# EAGLE design 4CoilController_v2 (EAGLE 9.6.2)
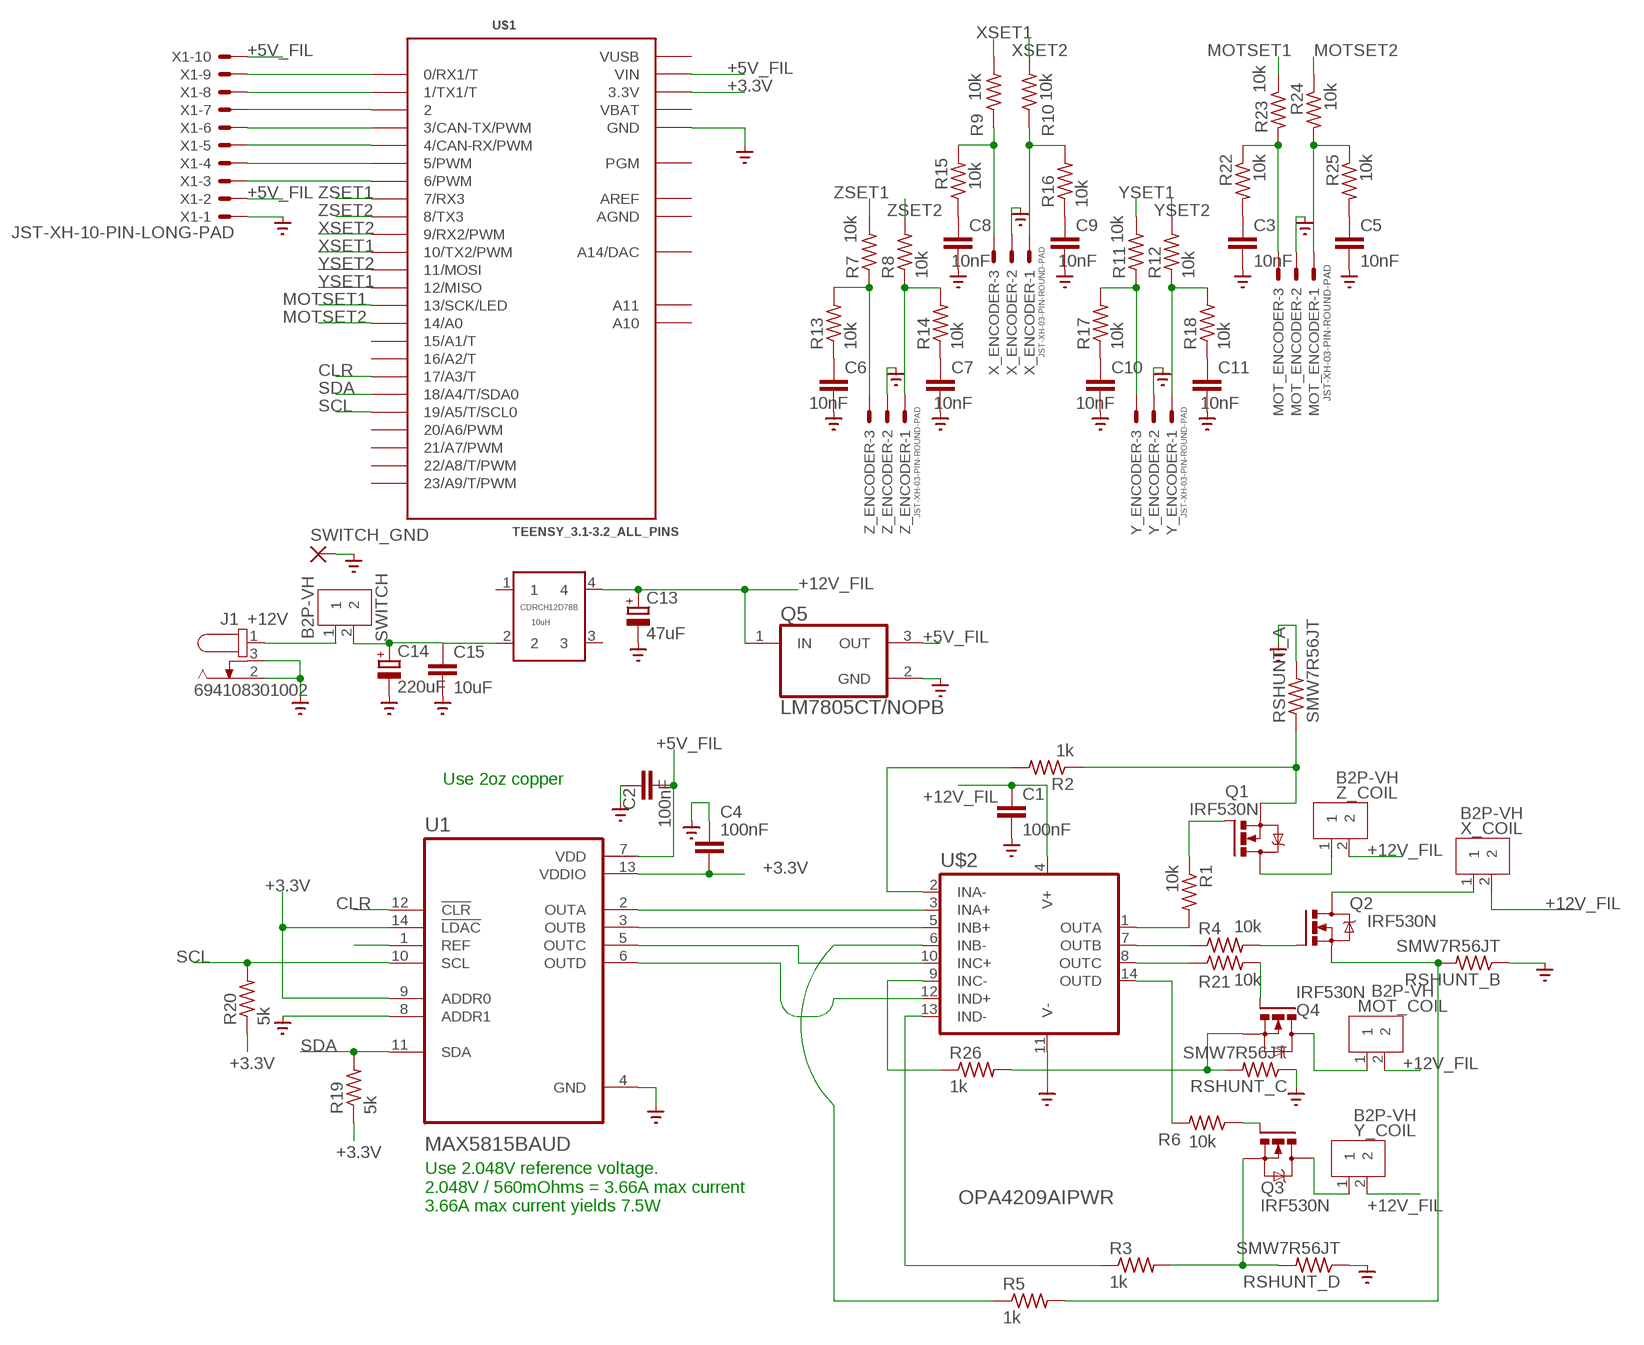
[diagram p0: schematic, sheet 1]

## Parts
C1  100nF  C-EUC0603  [C0603]
C2  100nF  C-EUC0603  [C0603]
C3  10nF  C-EUC0603  [C0603]
C4  100nF  C-EUC0603  [C0603]
C5  10nF  C-EUC0603  [C0603]
C6  10nF  C-EUC0603  [C0603]
C7  10nF  C-EUC0603  [C0603]
C8  10nF  C-EUC0603  [C0603]
C9  10nF  C-EUC0603  [C0603]
C10  10nF  C-EUC0603  [C0603]
C11  10nF  C-EUC0603  [C0603]
C13  47uF  CPOL-EU175TMP-0808  [175TMP-0808]
C14  220uF  CPOL-EUE3.5-8  [E3,5-8]
C15  10uF  C-EUC1206  [C1206]
J1  694108301002  [694108301002]
MOT_COIL  B2P-VH  [B2P-VH_396-2N]
MOT_ENCODER  JST-XH-03-PIN-ROUND-PAD  [JST-XH-03-PACKAGE-ROUND-PAD]
Q1  IRF530N  IRF540  [TO220BV]
Q2  IRF530N  IRF540  [TO220BV]
Q3  IRF530N  IRF540  [TO220BV]
Q4  IRF530N  IRF540  [TO220BV]
Q5  LM7805CT/NOPB  [TO254P1054X470X2600-3]
R1  10k  R-US_R1206  [R1206]
R2  1k  R-US_R1206  [R1206]
R3  1k  R-US_R1206  [R1206]
R4  10k  R-US_R1206  [R1206]
R5  1k  R-US_R1206  [R1206]
R6  10k  R-US_R1206  [R1206]
R7  10k  R-US_R0603  [R0603]
R8  10k  R-US_R0603  [R0603]
R9  10k  R-US_R0603  [R0603]
R10  10k  R-US_R0603  [R0603]
R11  10k  R-US_R0603  [R0603]
R12  10k  R-US_R0603  [R0603]
R13  10k  R-US_R0603  [R0603]
R14  10k  R-US_R0603  [R0603]
R15  10k  R-US_R0603  [R0603]
R16  10k  R-US_R0603  [R0603]
R17  10k  R-US_R0603  [R0603]
R18  10k  R-US_R0603  [R0603]
R19  5k  R-US_R0603  [R0603]
R20  5k  R-US_R0603  [R0603]
R21  10k  R-US_R0603  [R0603]
R22  10k  R-US_R0603  [R0603]
R23  10k  R-US_R0603  [R0603]
R24  10k  R-US_R0603  [R0603]
R25  10k  R-US_R0603  [R0603]
R26  1k  R-US_R0603  [R0603]
RSHUNT_A  SMW7R56JT  [SMW7R56JT]
RSHUNT_B  SMW7R56JT  [SMW7R56JT]
RSHUNT_C  SMW7R56JT  [SMW7R56JT]
RSHUNT_D  SMW7R56JT  [SMW7R56JT]
SWITCH  B2P-VH  [B2P-VH_396-2N]
SWITCH_GND  3,81/1,4  [3,81/1,4]
U1  MAX5815BAUD  [SOP65P640X110-14N]
U$1  TEENSY_3.1-3.2_ALL_PINS  [TEENSY_3.0-3.2&LC_ALL_PINS]
U$2  OPA4209AIPWR  [SOP65P640X120-14N]
U$3  10uH  CDRCH12D78BCDRCH12D78B  [INDDFN1220X1220X800-4N]
X1  JST-XH-10-PIN-LONG-PAD  [JST-XH-10-PACKAGE-LONG-PAD]
X_COIL  B2P-VH  [B2P-VH_396-2N]
X_ENCODER  JST-XH-03-PIN-ROUND-PAD  [JST-XH-03-PACKAGE-ROUND-PAD]
Y_COIL  B2P-VH  [B2P-VH_396-2N]
Y_ENCODER  JST-XH-03-PIN-ROUND-PAD  [JST-XH-03-PACKAGE-ROUND-PAD]
Z_COIL  B2P-VH  [B2P-VH_396-2N]
Z_ENCODER  JST-XH-03-PIN-ROUND-PAD  [JST-XH-03-PACKAGE-ROUND-PAD]

## Nets
+3.3V: C4.2 R19.1 R20.1 U1.9(ADDR0) U1.13(VDDIO) U1.14(!LDAC) U$1.3.3V U$1.3.3V1(3.3V)
+5V_FIL: C2.2 Q5.3(OUT) U1.7(VDD) U$1.VIN X1.2 X1.10
+12V: C14.+ C15.1 SWITCH.2 U$3.2
+12V_FIL: C1.1 C13.+ MOT_COIL.2 Q5.1(IN) U$2.4(V+) U$3.4 X_COIL.2 Y_COIL.2 Z_COIL.2
CLR: U1.12(!CLR) U$1.17/A3(17/A3/T)
GND: C1.2 C2.1 C3.2 C4.1 C5.2 C6.2 C7.2 C8.2 C9.2 C10.2 C11.2 C13.- C14.- C15.2 J1.2 J1.3 MOT_ENCODER.2 Q5.2(GND) RSHUNT_A.P$2 RSHUNT_B.P$1 RSHUNT_C.P$1 RSHUNT_D.P$1 SWITCH_GND.1(P) U1.4(GND) U1.8(ADDR1) U$1.GND U$1.GND1(GND) U$2.11(V-) X1.1 X_ENCODER.2 Y_ENCODER.2 Z_ENCODER.2 ; supply symbol labelled SUPPLY0_GND_
MOTSET1: R23.1 U$1.13(13/SCK/LED)
MOTSET2: R24.1 U$1.14/A0
N$1: U1.6(OUTD) U$2.12(IND+)
N$2: U1.3(OUTB) U$2.5(INB+)
N$3: R5.1 U$2.6(INB-)
N$4: U1.2(OUTA) U$2.3(INA+)
N$5: R1.2 U$2.1(OUTA)
N$6: R2.2 U$2.2(INA-)
N$7: Q1.G R1.1
N$8: Q1.S R2.1 RSHUNT_A.P$1
N$9: R7.1 R13.2 Z_ENCODER.3
N$10: Q1.D Z_COIL.1
N$11: R8.1 R14.2 Z_ENCODER.1
N$12: R4.1 U$2.7(OUTB)
N$13: Q2.G R4.2
N$14: Q2.S R5.2 RSHUNT_B.P$2
N$15: R3.1 U$2.13(IND-)
N$16: R6.2 U$2.14(OUTD)
N$17: Q2.D X_COIL.1
N$18: Q3.G R6.1
N$19: Q3.S R3.2 RSHUNT_D.P$2
N$20: Q3.D Y_COIL.1
N$21: R9.1 R15.2 X_ENCODER.3
N$22: R10.1 R16.2 X_ENCODER.1
N$23: R11.1 R17.2 Y_ENCODER.3
N$24: R12.1 R18.2 Y_ENCODER.1
N$25: C6.1 R13.1
N$26: C7.1 R14.1
N$27: C8.1 R15.1
N$28: C9.1 R16.1
N$29: C10.1 R17.1
N$30: C11.1 R18.1
N$31: J1.1 SWITCH.1
N$32: U$1.0(0/RX1/T) X1.9
N$33: U$1.1(1/TX1/T) X1.8
N$34: U$1.2 X1.7
N$35: U$1.3(3/CAN-TX/PWM) X1.6
N$36: U$1.4(4/CAN-RX/PWM) X1.5
N$37: U$1.5(5/PWM) X1.4
N$38: U$1.6(6/PWM) X1.3
N$39: U1.5(OUTC) U$2.10(INC+)
N$40: R26.1 U$2.9(INC-)
N$41: R21.1 U$2.8(OUTC)
N$42: U1.1(REF)
N$43: Q4.S R26.2 RSHUNT_C.P$2
N$44: Q4.G R21.2
N$45: MOT_COIL.1 Q4.D
N$47: MOT_ENCODER.3 R22.1 R23.2
N$48: MOT_ENCODER.1 R24.2 R25.1
N$50: C3.1 R22.2
N$51: C5.1 R25.2
SCL: R20.2 U1.10(SCL) U$1.19/A5(19/A5/T/SCL0)
SDA: R19.2 U1.11(SDA) U$1.18/A4(18/A4/T/SDA0)
XSET1: R9.2 U$1.10(10/TX2/PWM)
XSET2: R10.2 U$1.9(9/RX2/PWM)
YSET1: R11.2 U$1.12(12/MISO)
YSET2: R12.2 U$1.11(11/MOSI)
ZSET1: R7.2 U$1.7(7/RX3)
ZSET2: R8.2 U$1.8(8/TX3)
Unconnected: U$1.15/A1(15/A1/T) U$1.16/A2(16/A2/T) U$1.20/A6(20/A6/PWM) U$1.21/A7(21/A7/PWM) U$1.22/A8(22/A8/T/PWM) U$1.23/A9(23/A9/T/PWM) U$1.A10 U$1.A11 U$1.PGM U$1.RESET/DAC(A14/DAC) U$3.1 U$3.3

## Notes on the sheet
- Use 2oz copper
- Use 2.048V reference voltage. 
  2.048V / 560mOhms = 3.66A max current
  3.66A max current yields 7.5W

## Power pins joined to a net without a drawn wire
AGND: U$1.AGND
AREF: U$1.AREF
VBAT: U$1.VBAT
VUSB: U$1.VUSB

## Library data of the parts
C1-C11 C15 = rcl:C-EU: CAPACITOR, European symbol; SPICEPREFIX: C
C13 C14 = rcl:CPOL-EU: POLARIZED CAPACITOR, European symbol; SPICEPREFIX: C
J1 = 694108301002:694108301002: WR-DC DC Power Jack Right Angled (6.4) KIND PROPERTIES Quality Class 5 000 Mating cycles Type Right Angled MATERIAL PROPERTIES Insulator Material PA66 Insulator Flammability Rating UL94 V-0 Color Black Contact Material Copper Alloy Contact Type Stamped Center Pin Plating Gold Center Pin Terminal Plating Tin Tip Spring Material Tin Shunt Terminal Plating Tin GENERAL INFORMATION Operating Temperature -40 up to +85 °C Compliance RoHS ELECTRICAL PROPERTIES IR 1 5 A Working Voltage 30 V (AC) Withstanding Voltage 500 V (AC) Contact Resistance 50 mΩ RISO 100 MΩ PACKAGING PROPERTIES Packaging Bag <https://katalog.we-online.com/media/images/v2/o59009v209%20Family_WR-DC_DC_Power_Jack_Right_Angled_THT_69410x301002.jpg> Details see: https://katalog.we-online.com/en/em/DC_RIGHT_ANGLED_6_4_69410X301002 Updated by Ella Wu 2019-11-01 2019(C) Wurth Elektronik Check prices <https://pricing.snapeda.com/parts/694108301002/W%C3%BCrth%20Elektronik/view-part?ref=eda>; AVAILABILITY: In Stock; DESCRIPTION: Power Barrel Connector Jack 2.50mm ID (0.098), 5.50mm OD (0.217) Through Hole, Right Angle; MF: Würth Elektronik; MP: 694108301002; PACKAGE: None; PRICE: None; PURCHASE-URL: https://pricing.snapeda.com/search/part/694108301002/?ref=eda
MOT_COIL SWITCH X_COIL Y_COIL Z_COIL = Connector:B2P-VH: VH Connector Top Entry - 2POS, 3.96MM Details see: Datasheet <http://www.jst-mfg.com/product/pdf/eng/eVH.pdf>; CATEGORY: Connector; DESCRIPTION: CONN HEADER VERT 2POS 3.96MM; MANUFACTURER: JST Sales America Inc.; MPN: B2P-VH; OPERATING_TEMPERATURE: -25°C ~ 85°C; PART_STATUS: Active; ROHS_COMPLIANCE: RoHS2 Compliant; SERIES: VH; TYPE: Top Entry
MOT_ENCODER X_ENCODER Y_ENCODER Z_ENCODER = Rembrandt Electronics - JST XH Connectors v1-0:JST-XH-03-PIN: JST XH Connector 2 Pin Wire to board connector. Pitch: 2,54 mm, (0.100") Number of pins: 3 Created by Rembrandt Electronics www.rembrandtelectronics.com
Q1-Q4 = transistor-power:IRF540: HEXFET Power MOSFET
Q5 = LM7805CT_NOPB:LM7805CT/NOPB: Standard Regulator Pos 5V 1A 3-Pin(3+Tab) TO-220 Rail Check prices <https://pricing.snapeda.com/parts/LM7805CT/ON%20Semiconductor/view-part?ref=eda>; AVAILABILITY: Warning; DESCRIPTION: Linear Voltage Regulator IC Positive Fixed 1 Output 1A TO-220-3; MF: ON Semiconductor; MP: LM7805CT; PACKAGE: TO-220-3 ON Semiconductor; PRICE: None; PURCHASE-URL: https://pricing.snapeda.com/search/part/LM7805CT/?ref=eda
R1-R26 = rcl:R-US_: RESISTOR, American symbol; SPICEPREFIX: R
RSHUNT_A RSHUNT_B RSHUNT_C RSHUNT_D = SMW7R56JT:SMW7R56JT: 560 MOHM MILLIOHM 7W 7 WATT RESISTOR
SWITCH_GND = wirepad:3,81/1,4: THROUGH-HOLE PAD
U1 = MAX5815BAUD:MAX5815BAUD: Check prices <https://pricing.snapeda.com/parts/MAX5815BAUD%2B/Maxim%20Integrated/view-part?ref=eda>; AVAILABILITY: In Stock; DESCRIPTION: 12 Bit Digital to Analog Converter 4 14-TSSOP; MF: Maxim Integrated; MP: MAX5815BAUD+; PACKAGE: TSSOP-14 Maxim; PRICE: None
U$1 = Teensy_3_and_LC_Series_Boards_v1.4:TEENSY_3.1-3.2_ALL_PINS: Footprint for Teensy 3.1 or 3.2 board using all through-holes, i.e. the entire perimeter plus the 4 through-holes inboard (A10,A11,AREF, VUSB)
U$2 = OPA4209AIPWR:OPA4209AIPWR; DESCRIPTION: Quad, 2.2nV/rtHz, 18MHz, Precision, RRO, 36V Operational Amplifier 14-TSSOP -40 to 125; DIGI-KEY_PART_NUMBER: 296-49850-1-ND; MF: Texas Instruments; MP: OPA4209AIPWR; PACKAGE: TSSOP-14 Texas Instruments; PURCHASE-URL: https://pricing.snapeda.com/search/part/OPA4209AIPWR/?ref=eda
U$3 = CDRCH12D78B:CDRCH12D78B: SUMIDA POWER INDUCTOR
X1 = Rembrandt Electronics - JST XH Connectors v1-0:JST-XH-10-PIN: JST XH Connector 2 Pin Wire to board connector. Pitch: 2,54 mm, (0.100") Number of pins: 10 Created by Rembrandt Electronics www.rembrandtelectronics.com

## Board
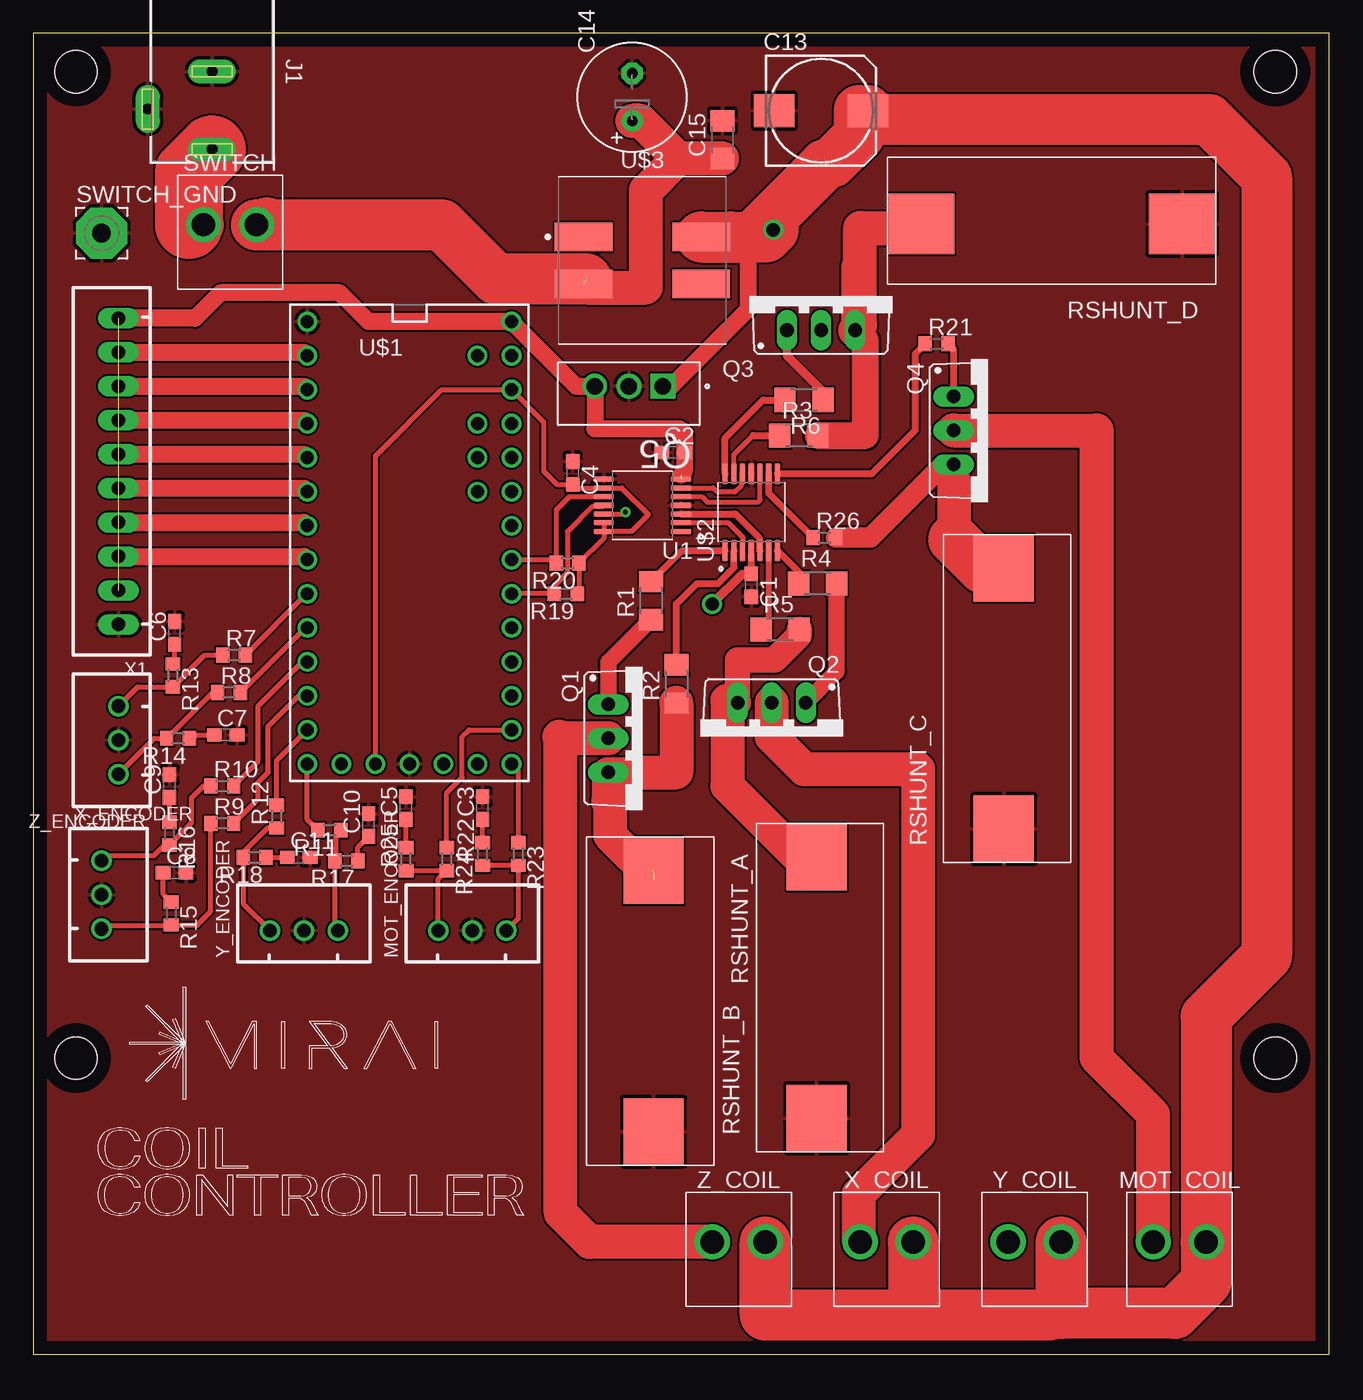
[diagram p1: board, top side]
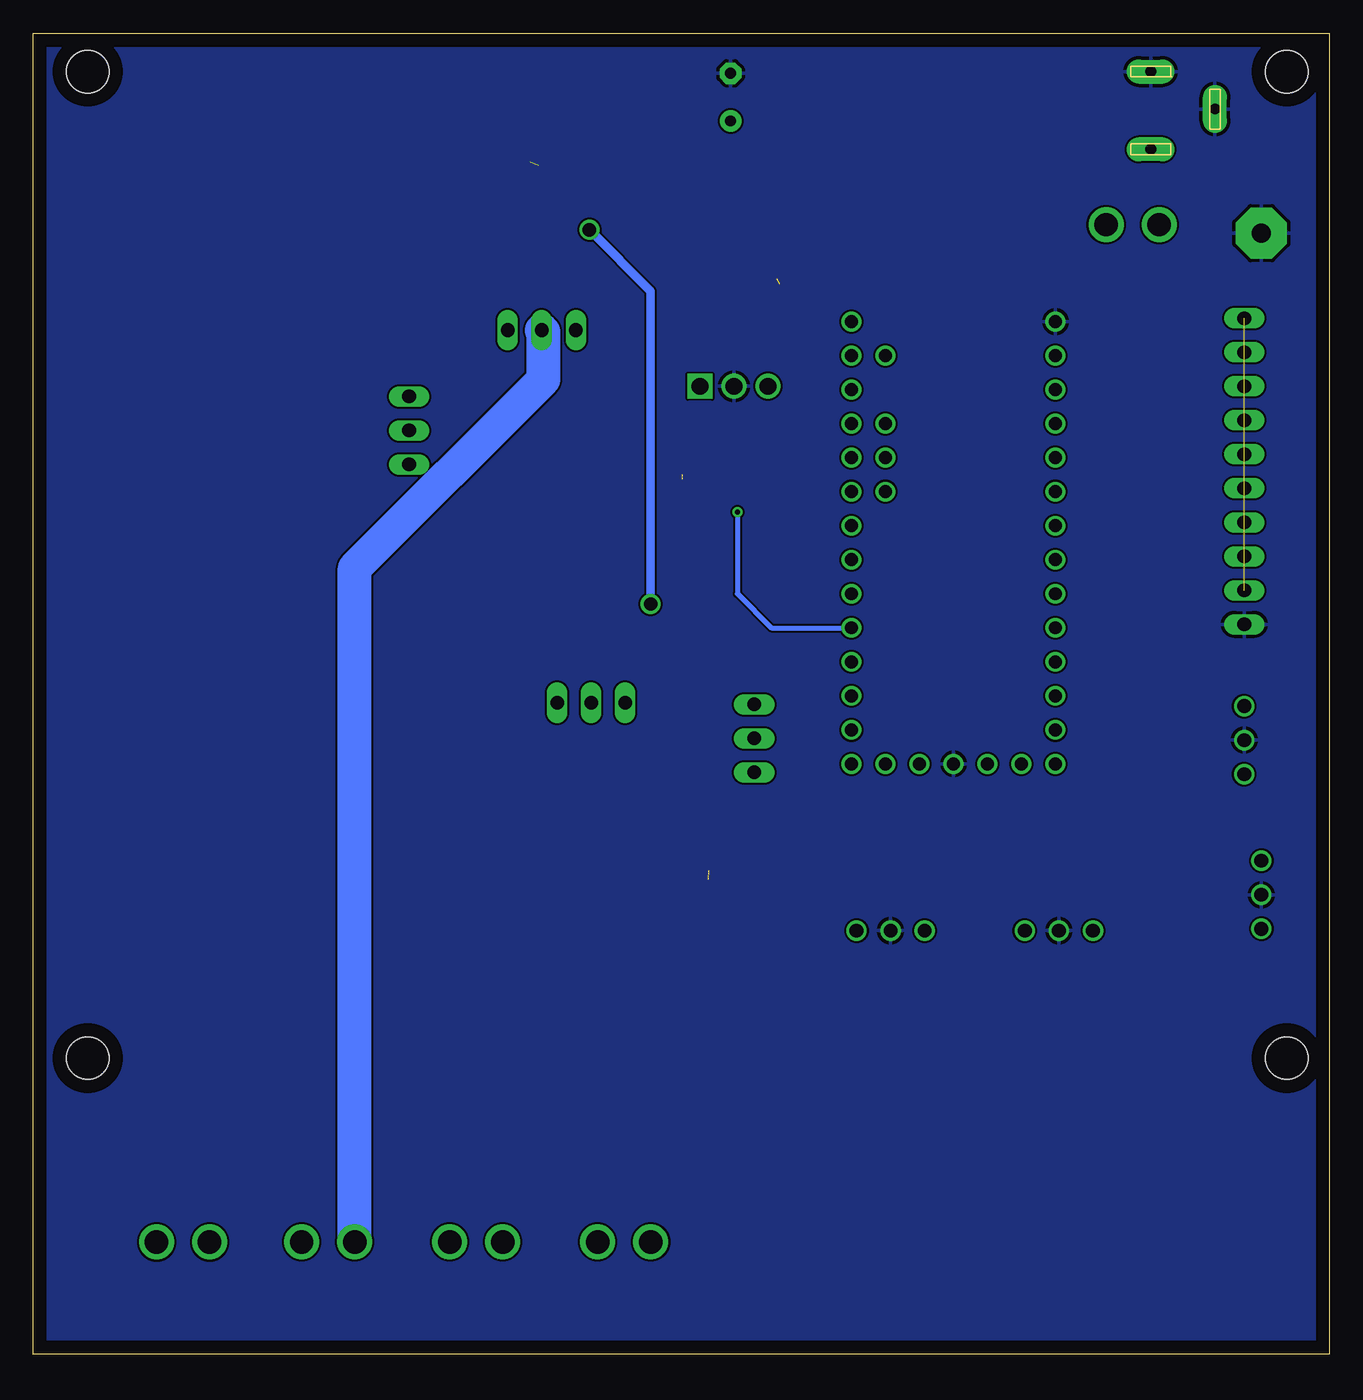
[diagram p2: board, bottom side, seen from below]

Size 96.75 x 98.6 mm. Coordinates in mm from the lower left corner, seen from the top.
Outline: 0,0 96.75,0 96.75,98.6 0,98.6 0,0
Copper layers (1*16): Top 0.035mm / dielectric 1.5mm / Bottom 0.035mm
Design rules "default": minimum track width 6mil, minimum drill 0.35mm, track to track 6mil, track to pad 6mil, pad to pad 6mil, via to via 6mil, smd to smd 6mil, copper to edge 40mil, drill to drill 6mil, minimum pad ring 10mil, minimum via ring 8mil, stop-mask expansion 4mil, vias tented up to drill 0mil, thermal gap 10mil
Holes 3.17 mm at 3.17,22.1 92.71,22.1 3.17,95.76 92.71,95.76

### Footprints (pad centres in the part's own frame; a part is rotated, then mirrored left to right if it is on the bottom)
C0603 = smd 1.1 x 1: 1 -0.85,0; 2 0.85,0
175TMP-0808 = smd 3 x 2.5: + 3.5,0; - -3.5,0
E3,5-8 = drill 0.813 pad 1.6: + -1.778,0 | drill 0.813 pad 1.6 octagon: - 1.778,0
C1206 = smd 1.6 x 1.8: 1 -1.4,0; 2 1.4,0
694108301002 = drill 0.8 pad 1.8 long: 1 5.8,0; 2 0,0; 3 2.8,-4.8
B2P-VH_396-2N = drill 1.75: 1 0,0; 2 3.96,0
JST-XH-03-PACKAGE-ROUND-PAD = drill 1.016: 1 -2.54,0; 2 0,0; 3 2.54,0
TO220BV = drill 1.016 long: D 0,-2.54; G -2.54,-2.54; S 2.54,-2.54
TO254P1054X470X2600-3 = drill 1.24 square: 1 0,0 | drill 1.24: 2 2.54,0; 3 5.08,0
R1206 = smd 1.6 x 1.803: 1 -1.422,0; 2 1.422,0
R0603 = smd 1 x 1.1: 1 -0.85,0; 2 0.85,0
SMW7R56JT = smd 5 x 4.5: P$1 2.5,-4.5; P$2 22,-4.5
3,81/1,4 = drill 1.397 pad 3.81 octagon: 1 0,0
SOP65P640X110-14N = smd 1.5 x 0.41: 1 -2.885,1.95; 2 -2.885,1.3; 3 -2.885,0.65; 4 -2.885,0; 5 -2.885,-0.65; 6 -2.885,-1.3; 7 -2.885,-1.95; 8 2.885,-1.95; 9 2.885,-1.3; 10 2.885,-0.65; 11 2.885,0; 12 2.885,0.65; 13 2.885,1.3; 14 2.885,1.95
TEENSY_3.0-3.2&LC_ALL_PINS = drill 0.965: 0 -7.62,13.97; 1 -7.62,11.43; 2 -7.62,8.89; 3 -7.62,6.35; 3.3V 7.62,11.43; 3.3V1 -2.54,-16.51; 4 -7.62,3.81; 5 -7.62,1.27; 6 -7.62,-1.27; 7 -7.62,-3.81; 8 -7.62,-6.35; 9 -7.62,-8.89; 10 -7.62,-11.43; 11 -7.62,-13.97; 12 -7.62,-16.51; 13 7.62,-16.51; 14/A0 7.62,-13.97; 15/A1 7.62,-11.43; 16/A2 7.62,-8.89; 17/A3 7.62,-6.35; 18/A4 7.62,-3.81; 19/A5 7.62,-1.27; 20/A6 7.62,1.27; 21/A7 7.62,3.81; 22/A8 7.62,6.35; 23/A9 7.62,8.89; A10 5.08,6.35; A11 5.08,3.81; AGND 7.62,13.97; AREF 5.08,8.89; GND -7.62,16.51; GND1 0,-16.51; PGM 2.54,-16.51; RESET/DAC 5.08,-16.51; VBAT -5.08,-16.51; VIN 7.62,16.51; VUSB 5.08,13.97
SOP65P640X120-14N = smd 1.57 x 0.41: 1 -2.87,1.95; 2 -2.87,1.3; 3 -2.87,0.65; 4 -2.87,0; 5 -2.87,-0.65; 6 -2.87,-1.3; 7 -2.87,-1.95; 8 2.87,-1.95; 9 2.87,-1.3; 10 2.87,-0.65; 11 2.87,0; 12 2.87,0.65; 13 2.87,1.3; 14 2.87,1.95
INDDFN1220X1220X800-4N = smd 4.312 x 2.112: 1 -4.4,1.75; 2 -4.4,-1.75; 3 4.4,-1.75; 4 4.4,1.75
JST-XH-10-PACKAGE-LONG-PAD = drill 1.016 long: 1 -11.43,0; 2 -8.89,0; 3 -6.35,0; 4 -3.81,0; 5 -1.27,0; 6 1.27,0; 7 3.81,0; 8 6.35,0; 9 8.89,0; 10 11.43,0

### Placement (x,y rotation side)
C1  53.59,57.4 270 top
C2  47.75,67.31 0 top
C3  33.53,40.77 90 top
C4  40.26,65.79 270 top
C5  27.81,40.77 90 top
C6  10.54,53.85 90 top
C7  14.35,46.23 0 top
C8  10.54,35.94 0 top
C9  10.16,42.42 90 top
C10  25.02,39.5 90 top
C11  19.81,37.08 0 top
C13  58.8,92.84 0 top
C14  44.7,93.85 90 top
C15  51.44,90.68 90 top
J1  13.34,95.76 270 top
MOT_COIL  83.6,8.37 0 top
MOT_ENCODER  32.77,31.62 0 top
Q1  45.47,45.97 270 top
Q2  55.12,46.1 180 top
Q3  58.8,78.99 0 top
Q4  71.25,68.96 270 top
Q5  46.99,72.26 180 top
R1  46.1,56.26 90 top
R2  48.01,50.04 90 top
R3  57.15,68.58 0 top
R4  58.55,57.53 0 top
R5  55.75,54.1 0 top
R6  57.53,71.25 180 top
R7  14.99,52.2 0 top
R8  14.61,49.4 0 top
R9  14.1,39.62 0 top
R10  14.1,42.42 0 top
R11  22.1,39.12 180 top
R12  18.16,40.13 90 top
R13  10.41,50.67 270 top
R14  10.79,45.97 180 top
R15  10.29,32.89 270 top
R16  10.16,38.86 270 top
R17  23.37,36.83 180 top
R18  16.51,37.08 180 top
R19  39.75,56.77 180 top
R20  39.88,59.05 180 top
R21  67.44,75.44 0 top
R22  33.53,37.34 90 top
R23  36.2,37.34 270 top
R24  30.86,36.96 270 top
R25  27.81,36.96 90 top
R26  59.05,60.96 0 top
RSHUNT_A  50.8,38.61 270 top
RSHUNT_B  53.98,15.11 90 top
RSHUNT_C  67.94,36.7 90 top
RSHUNT_D  88.27,79.88 180 top
SWITCH  12.7,84.33 0 top
SWITCH_GND  5.08,83.69 0 top
U1  45.47,63.37 180 top
U$1  28.07,60.58 0 top
U$2  53.59,62.86 90 top
U$3  45.47,81.66 0 top
X1  6.35,65.91 90 top
X_COIL  61.72,8.38 0 top
X_ENCODER  5.08,34.29 270 top
Y_COIL  72.77,8.38 0 top
Y_ENCODER  20.19,31.62 0 top
Z_COIL  50.67,8.38 0 top
Z_ENCODER  6.35,45.85 90 top

### Tracks (layer width: path | path; a pad name or v marks a point on that pad's centre or on a via)
+3.3V
  Top 0.381: U$1.3.3V1 25.53,67.06 30.48,72.01 U$1.3.3V 38.1,69.6 38.1,65.91 39.08,64.94 C4.2 40.52,64.67 U1.9 43.91,64.67 45.91,62.67 44.66,61.42 U1.14 | U1.13 U1.14 | U1.14 42.58,60.91 R20.1 40.73,56.9 R19.1
+5V_FIL  (2 unrouted)
  Top 1.27: 48.35,65.66 48.6,65.92 C2.2 48.6,68.75 48.26,69.09 41.91,69.09 Q5.3 40.51,72.26 U$1.VIN 25.02,77.09 22.86,79.25 13.97,79.25 12.06,77.34 X1.10
+12V  (1 unrouted)
  Top 2.54: U$3.2 41.35,79.63 45.72,79.63 45.72,86.87 48.13,89.28 | 48.13,89.28 C15.1 | 48.13,89.28 45.33,92.08 C14.+
  Top 3.81: 17.42,84.45 17.3,84.33 SWITCH.2 30.48,84.33 34.51,80.3 41.27,80.3
+12V_FIL  (via drill 1)  (1 unrouted)
  Top 0.381: U$2.4 C1.1
  Top 0.508: C1.1 53.59,59.69 53.6,59.7
  Top 0.635: v50.67,56.01 52.92,58.25 C1.1
  Top 1.27: 52.07,83.41 53.34,82.14 53.34,77.98 47.62,72.26 Q5.1
  Top 2.54: Y_COIL.2 76.73,3.83 75.82,2.92
  Top 3.81: 65.68,2.92 75.82,2.92 | 65.68,2.92 54.63,2.92 Z_COIL.2 | X_COIL.2 65.68,2.92 | Y_COIL.2 76.73,3.05 85.22,3.05 87.56,5.39 MOT_COIL.2 87.56,25.21 92.08,29.72 92.08,87.88 87.76,92.2 62.94,92.2 C13.+ 61.67,92.84 61.67,91 59.69,89.03 | U$3.4 52.07,83.41 53.69,83.41 | 53.69,83.41 59.05,88.77 | v55.24,83.95 54.71,83.41 53.69,83.41
  Bottom 0.635: v50.67,56.01 50.67,79.38 v55.24,83.95
CLR  (via drill 0.35)
  Top 0.381: U1.12 44.05,62.72 v44.2,62.86
  Bottom 0.381: v44.2,62.86 44.2,56.77 41.66,54.23 U$1.17/A3
GND
  pour Top: 0,98.3 96.52,98.3 96.52,-0.13 0,-0.13
  pour Bottom: 0,98.3 96.52,98.3 96.52,-0.13 -0.64,-0.13 -0.64,97.66
MOTSET1
  Top 0.381: U$1.13 36.2,43.56 R23.1
MOTSET2
  Top 0.381: R24.1 30.86,41.91 32,43.05 32,46.1 32.51,46.61 U$1.14/A0
N$1
  Top 0.381: U1.6 50.77,64.67 51.05,64.39 52.39,64.39 52.89,64.89 52.89,65.68 U$2.12
N$2
  Top 0.508: U$2.5 54.2,60.03 54.2,60.92 52.4,62.72 U1.3
N$3
  Top 0.457: U$2.6 54.89,54.67
  Top 0.508: 54.89,54.67 R5.1
N$4
  Top 0.381: U1.2 51.85,62.07 52.97,60.95 52.97,60.83 52.97,60.02 | 52.97,60.02 52.97,59.99 | U$2.3 52.97,60.02
N$5
  Top 0.508: R1.2 48.41,59.99 U$2.1
N$6
  Top 0.381: U$2.2 52.29,58.73 51.96,58.4
  Top 0.508: 52.3,59.99 52.3,58.74 51.96,58.4 51.1,57.53 49.53,57.53 48.01,56.01 R2.2
N$7
  Top 1.245: Q1.G 42.93,51.66 R1.1
N$8  (1 unrouted)
  Top 2.032: 43.05,38.99 42.93,39.12 42.93,43.28 | 42.93,43.28 Q1.S 45.09,43.43 | 48.01,43.43 47.85,43.28 42.93,43.28
  Top 2.54: 43.05,41.15 43.05,38.99 43.05,38.73 46.35,35.43 | 43.05,42.67 43.05,41.15 | 43.05,41.15 42.93,41.28 42.93,43.28 44.93,43.28 45.09,43.43 48.01,43.43 R2.1
N$9
  Top 0.381: Z_ENCODER.3 7.79,49.82 R13.2 12.79,52.2 R7.1
N$10
  Top 2.54: Q1.D 39.37,45.97 | 39.37,45.97 39.24,46.1 | 39.37,45.97 39.37,10.54 41.53,8.38 Z_COIL.1
N$11
  Top 0.381: R8.1 13.37,49.4 R14.2 9.02,45.97 Z_ENCODER.1
N$12
  Top 0.508: U$2.7 57.12,58.41 R4.1
N$13
  Top 1.245: Q2.G 59.97,50.95 R4.2
N$14
  Top 1.905: Q2.S 52.58,51.82 55.31,51.82 57.17,53.68 R5.2
  Top 2.032: 51.82,48.77 52.45,48.77 Q2.S
  Top 2.54: 51.82,48.77 51.82,42.42 57.12,37.11 RSHUNT_B.P$2
N$15
  Top 0.381: U$2.13 52.29,67.15 53.72,68.58
  Top 0.508: 53.72,68.58 R3.1
N$16
  Top 0.508: U$2.14 51.64,68.41 54.48,71.25 R6.2
N$17
  Top 2.54: Q2.D 55.12,46.1 57.53,43.69 66.04,43.69 66.04,16.38 61.59,11.94 61.59,8.51 X_COIL.1
N$18
  Top 0.635: Q3.G 56.26,74.55 58.95,71.86 R6.1
N$19
  Top 2.032: 61.34,81.25 Q3.S 62.1,75.69 62.1,68.58 R3.2
  Top 2.54: Q3.S 61.72,76.83 61.72,84.07 66.67,84.07 66.37,84.38 RSHUNT_D.P$2
N$20
  Bottom 2.54: Y_COIL.1 72.77,58.67 58.67,72.77 58.67,76.33 Q3.D
N$21
  Top 0.381: X_ENCODER.3 5.33,32 10.25,32 R15.2 12.23,32.04 13.25,33.06 R9.1
N$22
  Top 0.381: X_ENCODER.1 5.46,37.21 8.98,37.21 9.78,38.01 R16.2 11.81,39.66 11.81,41.53 12.7,42.42 R10.1
N$23
  Top 0.381: Y_ENCODER.3 22.52,31.84 R17.2 22.57,36.88 22.57,38.73 R11.1
N$24
  Top 0.381: R12.1 17.48,39.28 15.66,37.47 R18.2 15.66,33.62 Y_ENCODER.1
N$25
  Top 0.381: R13.1 10.54,51.65 C6.1
N$26
  Top 0.381: R14.1 11.9,46.23 C7.1
N$27
  Top 0.381: R15.1 9.69,34.34 C8.1
N$28
  Top 0.381: R16.1 C9.1
N$29
  Top 0.381: C10.1 24.22,37.85 R17.1
N$30
  Top 0.381: C11.1 | R18.1 C11.1
N$31
  Top 3.048: 11.59,84.33 SWITCH.1
  Top 5.08: J1.1 11.59,88.21 11.59,84.33
N$32
  Top 1.27: X1.9 20.19,74.8 U$1.0
N$33
  Top 1.27: X1.8 20.19,72.26 U$1.1
N$34
  Top 1.27: X1.7 20.19,69.72 U$1.2
N$35
  Top 1.27: X1.6 20.19,67.18 U$1.3
N$36
  Top 1.27: X1.5 20.19,64.64 U$1.4
N$37
  Top 1.27: X1.4 20.19,62.1 U$1.5
N$38
  Top 1.27: X1.3 20.19,59.56 U$1.6
N$39
  Top 0.381: U1.5 49.9,64.02 50.29,63.63 54.1,63.63 54.24,63.77 U$2.10
N$40
  Top 0.508: U$2.9 54.89,64.27 R26.1
N$41
  Top 0.508: U$2.8 62.6,65.73 65.83,68.96 65.83,74.68 R21.1
N$43
  Top 1.524: R26.2 62.48,60.96 67.94,66.42 Q4.S 68.71,65.15 68.71,62.32
  Top 2.54: 68.71,65.15 68.71,60.84
  Top 3.81: 68.71,60.84 70.84,58.7 RSHUNT_C.P$2
N$44
  Top 0.508: R21.2 68.67,75.06 68.67,71.5 Q4.G
N$45
  Top 2.54: Q4.D 79.38,68.96 79.38,22.13 83.6,17.9 MOT_COIL.1
N$47
  Top 0.381: MOT_ENCODER.3 36.2,32.51 R23.2 R22.1
N$48
  Top 0.381: MOT_ENCODER.1 30.23,35.47 R24.2 R25.1
N$50
  Top 0.381: R22.2 C3.1
N$51
  Top 0.381: R25.2 C5.1
SCL
  Top 0.381: U$1.19/A5 38.77,59.31 R20.2 39.03,63.03 40.01,64.01 42.57,64.01 U1.10
SDA
  Top 0.381: U1.11 42.48,63.27 41.72,63.27 39.87,61.42 39.87,58.36 38.9,57.39 R19.2 U$1.18/A4
XSET1
  Top 0.381: R9.2 16.76,41.44 16.76,42.67 17.53,43.43 17.53,46.86 19.81,49.15 U$1.10
XSET2
  Top 0.381: R10.2 16.76,44.23 16.76,48.39 20.07,51.69 U$1.9
YSET1
  Top 0.381: R11.2 20.45,39.92 U$1.12
YSET2
  Top 0.381: R12.2 18.16,44.32 U$1.11
ZSET1
  Top 0.381: R7.2 20.41,56.77 U$1.7
ZSET2
  Top 0.381: U$1.8 20.28,54.23 R8.2